# Altium project Workstation Controls.PrjPcb
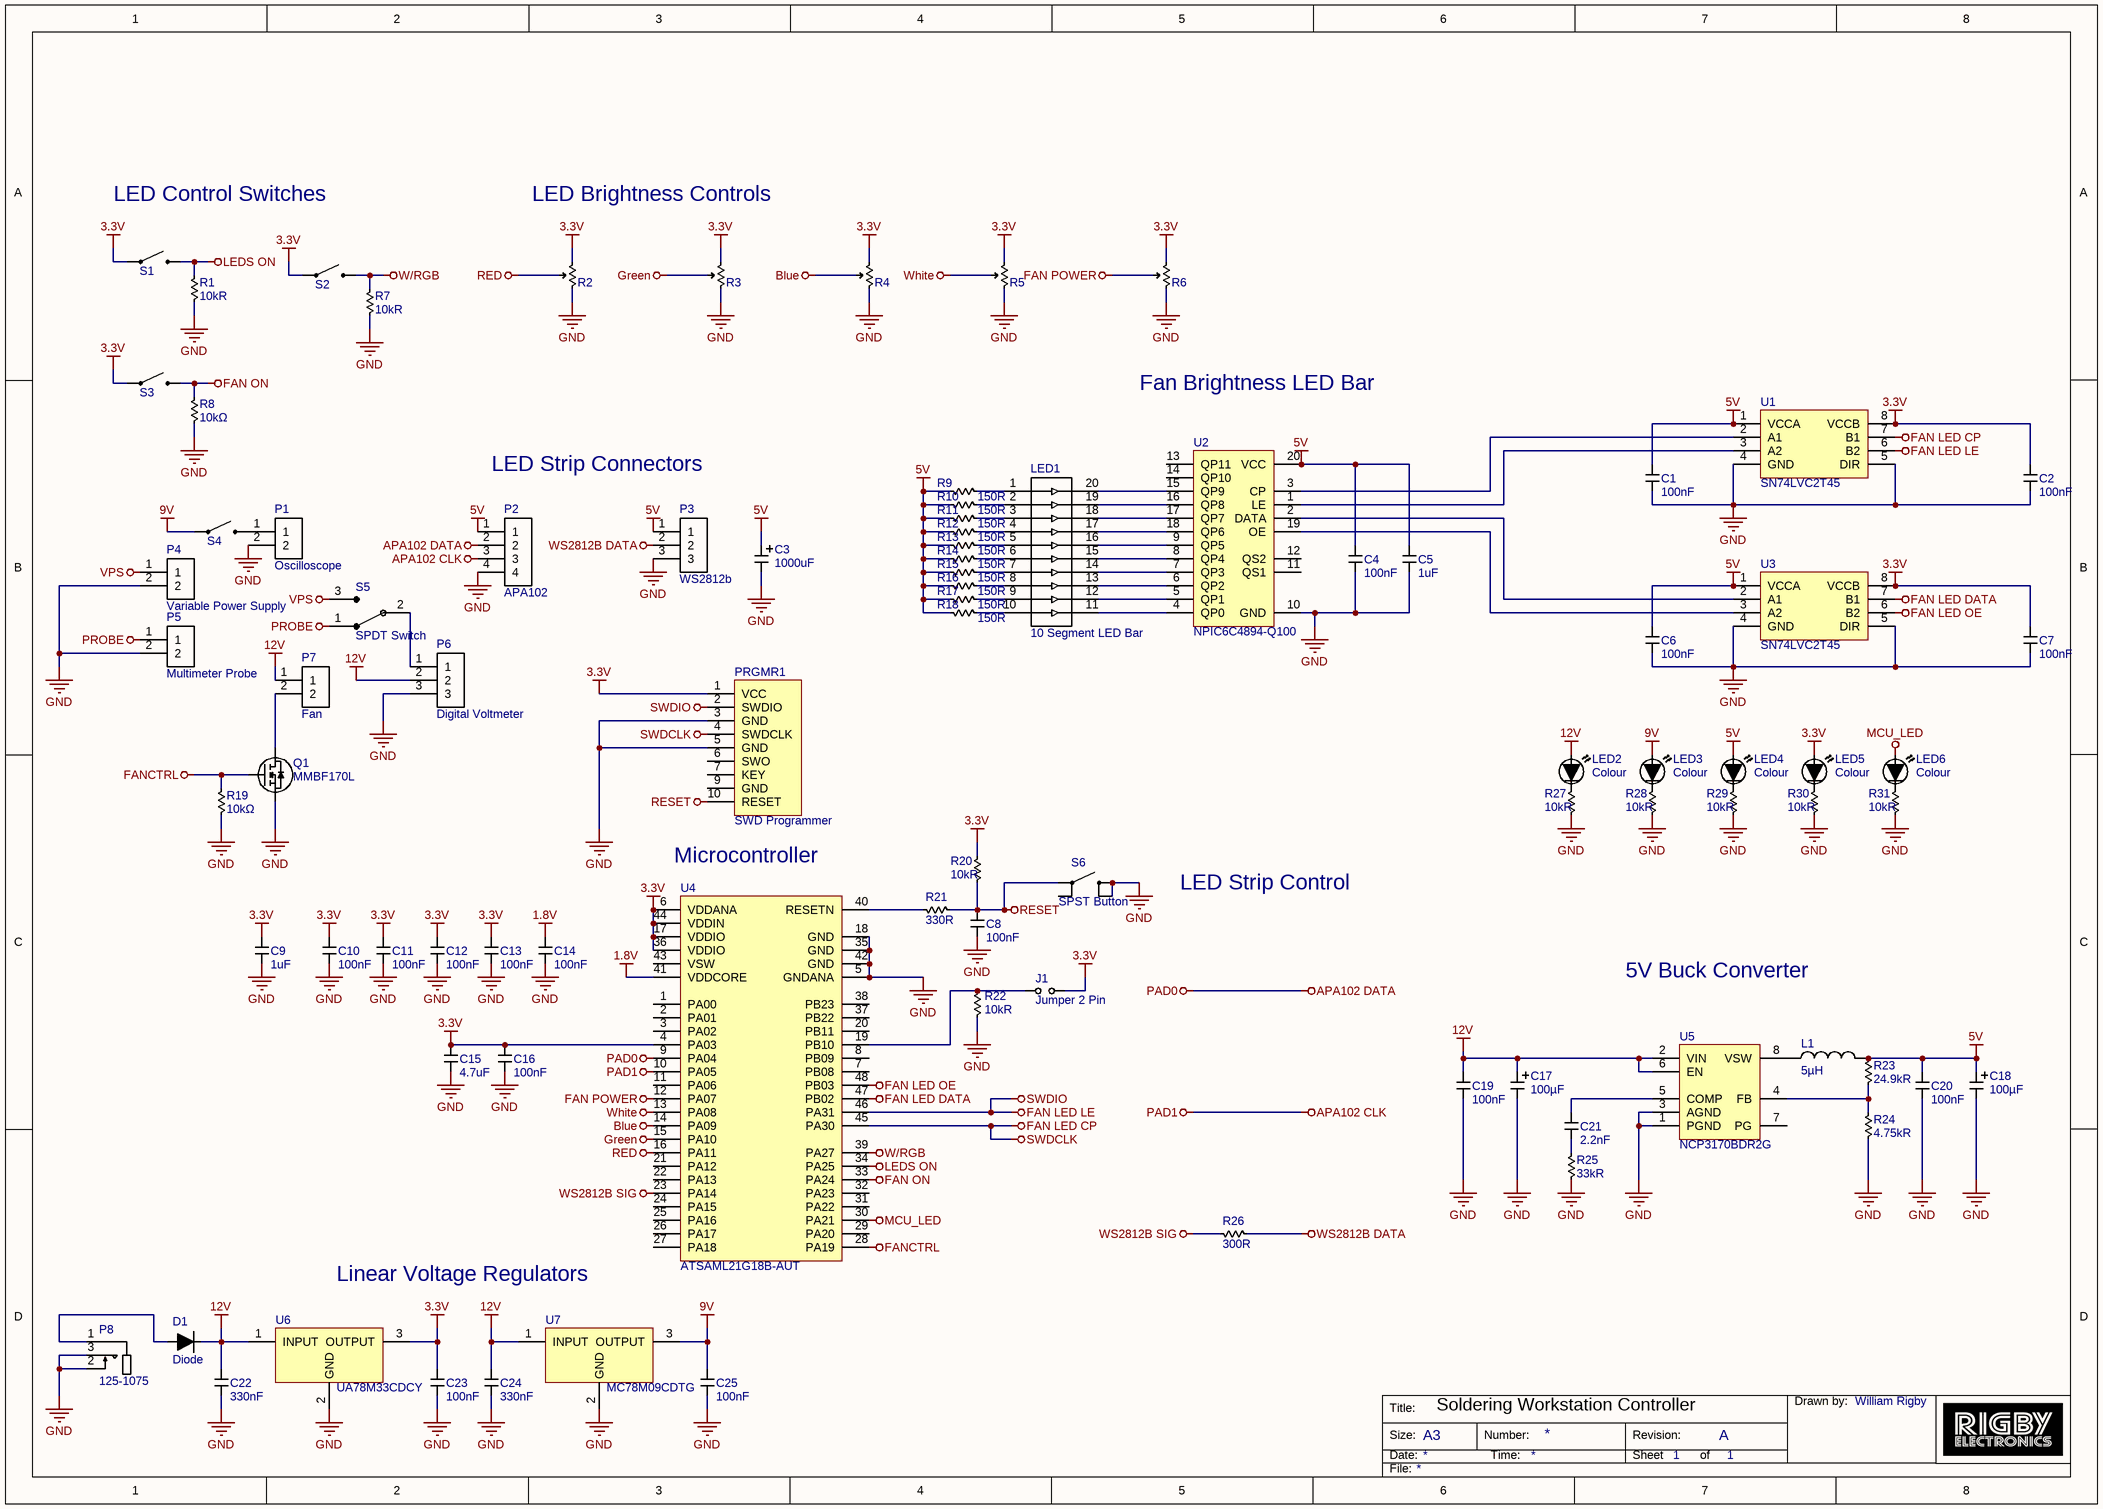
[diagram p0: Schematic.SchDoc]
1 sheet, 88 parts. Net scope: global (net labels, ports and power ports of the same name join across sheets).

## Sheet Schematic.SchDoc: Soldering Workstation Controller
size A3; Author: William Rigby; CompanyName: Rigby Electronics; Engineer: William Rigby; Organization: Rigby Electronics; Revision: A; SheetNumber: 1; SheetTotal: 1

### Parts
C1  100nF  [0603]
C2  100nF  [0603]
C3  1000uF  [RS 711-0987]
C4  100nF  [0603]
C5  1uF  [0805]
C6  100nF  [0603]
C7  100nF  [0603]
C8  100nF  [0603]
C9  1uF  [0805]
C10  100nF  [0603]
C11  100nF  [0603]
C12  100nF  [0603]
C13  100nF  [0603]
C14  100nF  [0603]
C15  4.7uF  [0805]
C16  100nF  [0603]
C17  100µF  [Nichon UCD0J102MNL1GS]
C18  100µF  [Nichon UCD0J102MNL1GS]
C19  100nF  [0603]
C20  100nF  [0603]
C21  2.2nF  [0603]
C22  330nF  [0603]
C23  100nF  [0603]
C24  330nF  [0603]
C25  100nF  [0603]
D1  Diode  [S5DC-13-F]
J1  Jumper 2 Pin  [Jumper 2 Pins]
L1  5µH  [SRU1038-5R0Y]
LED1  10 Segment LED Bar  [LED Bar 10 Segment]
LED2  Colour  [0603LED]
LED3  Colour  [0603LED]
LED4  Colour  [0603LED]
LED5  Colour  [0603LED]
LED6  Colour  [0603LED]
P1  Oscilloscope  [S2B-XH-A(LF)(SN)]
P2  APA102  [S4B-XH-A(LF)(SN)]
P3  WS2812b  [S3B-XH-A(LF)(SN)]
P4  Variable Power Supply  [S2B-XH-A(LF)(SN)]
P5  Multimeter Probe  [S2B-XH-A(LF)(SN)]
P6  Digital Voltmeter  [S3B-XH-A(LF)(SN)]
P7  Fan  [S2B-XH-A(LF)(SN)]
P8  125-1075  [RS-PRO 125-1075]
PRGMR1  SWD Programmer  [HEADER 5X2]
Q1  MMBF170L  [MMBF170L]
R1  10kR  [0603]
R2  Potentiometer  [S3B-XH-A(LF)(SN)]  (value not drawn)
R3  Potentiometer  [S3B-XH-A(LF)(SN)]  (value not drawn)
R4  Potentiometer  [S3B-XH-A(LF)(SN)]  (value not drawn)
R5  Potentiometer  [S3B-XH-A(LF)(SN)]  (value not drawn)
R6  Potentiometer  [S3B-XH-A(LF)(SN)]  (value not drawn)
R7  10kR  [0603]
R8  10kΩ  [0603]
R9  150R  [0603]
R10  150R  [0603]
R11  150R  [0603]
R12  150R  [0603]
R13  150R  [0603]
R14  150R  [0603]
R15  150R  [0603]
R16  150R  [0603]
R17  150R  [0603]
R18  150R  [0603]
R19  10kΩ  [0603]
R20  10kR  [0603]
R21  330R  [0603]
R22  10kR  [0603]
R23  24.9kR  [0603]
R24  4.75kR  [0603]
R25  33kR  [0603]
R26  300R  [0603]
R27  10kR  [0603]
R28  10kR  [0603]
R29  10kR  [0603]
R30  10kR  [0603]
R31  10kR  [0603]
S1  SPST Switch  [S2B-XH-A(LF)(SN)]  (value not drawn)
S2  SPST Switch  [S2B-XH-A(LF)(SN)]  (value not drawn)
S3  SPST Switch  [S2B-XH-A(LF)(SN)]  (value not drawn)
S4  SPST Switch  [S2B-XH-A(LF)(SN)]  (value not drawn)
S5  SPDT Switch  [S3B-XH-A(LF)(SN)]
S6  SPST Button  [TE 4-1437565-1]
U1  SN74LVC2T45  [SN74LVC2T45DCU]
U2  NPIC6C4894-Q100  [NPIC6C4894-Q100]
U3  SN74LVC2T45  [SN74LVC2T45DCU]
U4  ATSAML21G18B-AUT  [ATSAMD21G18A-AU]
U5  NCP3170BDR2G  [NCP3170BDR2G]
U6  UA78M33CDCY  [UA78M33CDCY]
U7  MC78M09CDTG  [MC78M09CDTG]

### Nets
1.8V: C14.1 U4.41(VDDCORE)
3.3V: C2.1 C7.1 C9.1 C10.1 C11.1 C12.1 C13.1 C15.1 C16.1 C23.1 J1.1 LED5.1 PRGMR1.1(VCC) R2.3 R3.3 R4.3 R5.3 R6.3 R20.2 S1.1 S2.1 S3.1 U1.8(VCCB) U3.8(VCCB) U4.4(PA03) U4.6(VDDANA) U4.17(VDDIO) U4.36(VDDIO) U4.44(VDDIN) U6.3(OUTPUT)
5V: C1.1 C3.1 C4.1 C5.1 C6.1 C18.1 C20.1 L1.1 LED4.1 P2.1 P3.1 R9.2 R10.2 R11.2 R12.2 R13.2 R14.2 R15.2 R16.2 R17.2 R18.2 R23.2 U1.1(VCCA) U2.20(VCC) U3.1(VCCA)
9V: C25.1 LED3.1 S4.1 U7.3(OUTPUT)
12V: C17.1 C19.1 C22.1 C24.1 D1.2 LED2.1 P6.2 P7.1 U5.2(VIN) U5.6(EN) U6.1(INPUT) U7.1(INPUT)
APA102 CLK: P2.3 U4.10(PA05)  [also labelled PAD1]
APA102 DATA: P2.2 U4.9(PA04)  [also labelled PAD0]
Blue: R4.2 U4.14(PA09)
FAN LED CP: PRGMR1.4(SWDCLK) U1.7(B1) U4.45(PA30)  [also labelled SWDCLK]
FAN LED DATA: U3.7(B1) U4.47(PB02)
FAN LED LE: PRGMR1.2(SWDIO) U1.6(B2) U4.46(PA31)  [also labelled SWDIO]
FAN LED OE: U3.6(B2) U4.48(PB03)
FAN ON: R8.2 S3.2 U4.33(PA24)
FAN POWER: R6.2 U4.12(PA07)
FANCTRL: Q1.G R19.2 U4.28(PA19)
GND: C1.2 C2.2 C3.2 C4.2 C5.2 C6.2 C7.2 C8.2 C9.2 C10.2 C11.2 C12.2 C13.2 C14.2 C15.2 C16.2 C17.2 C18.2 C19.2 C20.2 C22.2 C23.2 C24.2 C25.2 P1.2 P2.4 P3.3 P4.2 P5.2 P6.3 P8.2 P8.3 PRGMR1.3(GND) PRGMR1.5(GND) Q1.S R1.1 R2.1 R3.1 R4.1 R5.1 R6.1 R7.1 R8.1 R19.1 R22.1 R24.1 R25.1 R27.1 R28.1 R29.1 R30.1 R31.1 S6.3 S6.4 U1.4(GND) U1.5(DIR) U2.10(GND) U3.4(GND) U3.5(DIR) U4.5(GNDANA) U4.18(GND) U4.35(GND) U4.42(GND) U5.1(PGND) U5.3(AGND) U6.2(GND) U7.2(GND)
Green: R3.2 U4.15(PA10)
LEDS ON: R1.2 S1.2 U4.34(PA25)
MCU_LED: LED6.1 U4.30(PA21)
PROBE: P5.1 S5.1
RED: R2.2 U4.16(PA11)
RESET: C8.1 PRGMR1.10(RESET) R20.1 R21.1 S6.1
VPS: P4.1 S5.3
W/RGB: R7.2 S2.2 U4.39(PA27)
White: R5.2 U4.13(PA08)
WS2812B DATA: P3.2 R26.2
WS2812B SIG: R26.1 U4.23(PA14)
NetC21_1: C21.1 U5.5(COMP)
NetC21_2: C21.2 R25.2
NetD1_1: D1.1 P8.1
NetJ1_2: J1.2 R22.2 U4.19(PB10)
NetL1_2: L1.2 U5.8(VSW)
NetLED1_1: LED1.1 R9.1
NetLED1_2: LED1.2 R10.1
NetLED1_3: LED1.3 R11.1
NetLED1_4: LED1.4 R12.1
NetLED1_5: LED1.5 R13.1
NetLED1_6: LED1.6 R14.1
NetLED1_7: LED1.7 R15.1
NetLED1_8: LED1.8 R16.1
NetLED1_9: LED1.9 R17.1
NetLED1_10: LED1.10 R18.1
NetLED1_11: LED1.11 U2.4(QP0)
NetLED1_12: LED1.12 U2.5(QP1)
NetLED1_13: LED1.13 U2.6(QP2)
NetLED1_14: LED1.14 U2.7(QP3)
NetLED1_15: LED1.15 U2.8(QP4)
NetLED1_16: LED1.16 U2.9(QP5)
NetLED1_17: LED1.17 U2.18(QP6)
NetLED1_18: LED1.18 U2.17(QP7)
NetLED1_19: LED1.19 U2.16(QP8)
NetLED1_20: LED1.20 U2.15(QP9)
NetLED2_2: LED2.2 R27.2
NetLED3_2: LED3.2 R28.2
NetLED4_2: LED4.2 R29.2
NetLED5_2: LED5.2 R30.2
NetLED6_2: LED6.2 R31.2
NetP1_1: P1.1 S4.2
NetP6_1: P6.1 S5.2
NetP7_2: P7.2 Q1.D
NetR21_2: R21.2 U4.40(RESETN)
NetR23_1: R23.1 R24.2 U5.4(FB)
NetU1_2: U1.2(A1) U2.3(CP)
NetU1_3: U1.3(A2) U2.1(LE)
NetU2_2: U2.2(DATA) U3.2(A1)
NetU2_19: U2.19(OE) U3.3(A2)

Not connected (* = marked no-connect by the designer): PRGMR1 6(SWO) 7(KEY) 9(GND); S6 2; U2 11(QS1) 12(QS2) 13(QP11) 14(QP10); U4 1(PA00) 2(PA01) 3(PA02) 7(PB08) 8(PB09) 11(PA06) 20(PB11) 21(PA12) 22(PA13) 24(PA15) 25(PA16) 26(PA17) 27(PA18) 29(PA20) 31(PA22) 32(PA23) 37(PB22) 38(PB23) 43(VSW); U5 7(PG)

### Notes on the sheet
- LED Control Switches
- LED Brightness Controls
- Fan Brightness LED Bar
- LED Strip Connectors
- Microcontroller
- LED Strip Control
- 5V Buck Converter
- Linear Voltage Regulators
- Title:
- Size:
- Date:
- A3
- Number:
- Time:
- Revision:
- Sheet
- of
- Drawn by:
- File:

### Library data of the parts
C1 C2 C4-C16 C19-C25 = Capacitor
C3 C17 C18 = Capacitor Polarized: Polarized Capacitor
J1 = Jumper 2 Pin: 2 Pin Jumper
L1 = Inductor
LED1 = LED BAR
LED2-LED6 = LED: Light Emitting Diode
P1 P4 P5 P7 = Header 2: 2 Pin Header
P2 = Header 4: 4 Pin Header
P3 P6 = Header 3: 3 Pin Header
P8 = DC Power Connector RS-PRO 125-1075: 2.1mm DC Power Socket
PRGMR1 = SWD Programmer: Atmel ICE Programmer
Q1 = MMBF170L: N-Channel Logic Level MOSFET
R1 R7-R31 = Resistor: Standard Resistor
S6 = SPST Button: SPST Switch
U1 U3 = SN74LVC2T45: Dual-Bit Bus Transceiver
U2 = NPIC6C4894-Q100: Power logic 12-bit shift register; open-drain output
U4 = ATSAML21G18B-AUT: 32-Bit Microcontroller, 48MHz, 256kB
U5 = NCP3170BDR2G: Synchronous PWM Switching Converter 3A
U6 = UA78M33CDCY: Linear Voltage Regulator 3.3V 500mA 25V Input
U7 = MC78M09CDTG: Linear Voltage Regulator 9V 700mA 35V Input